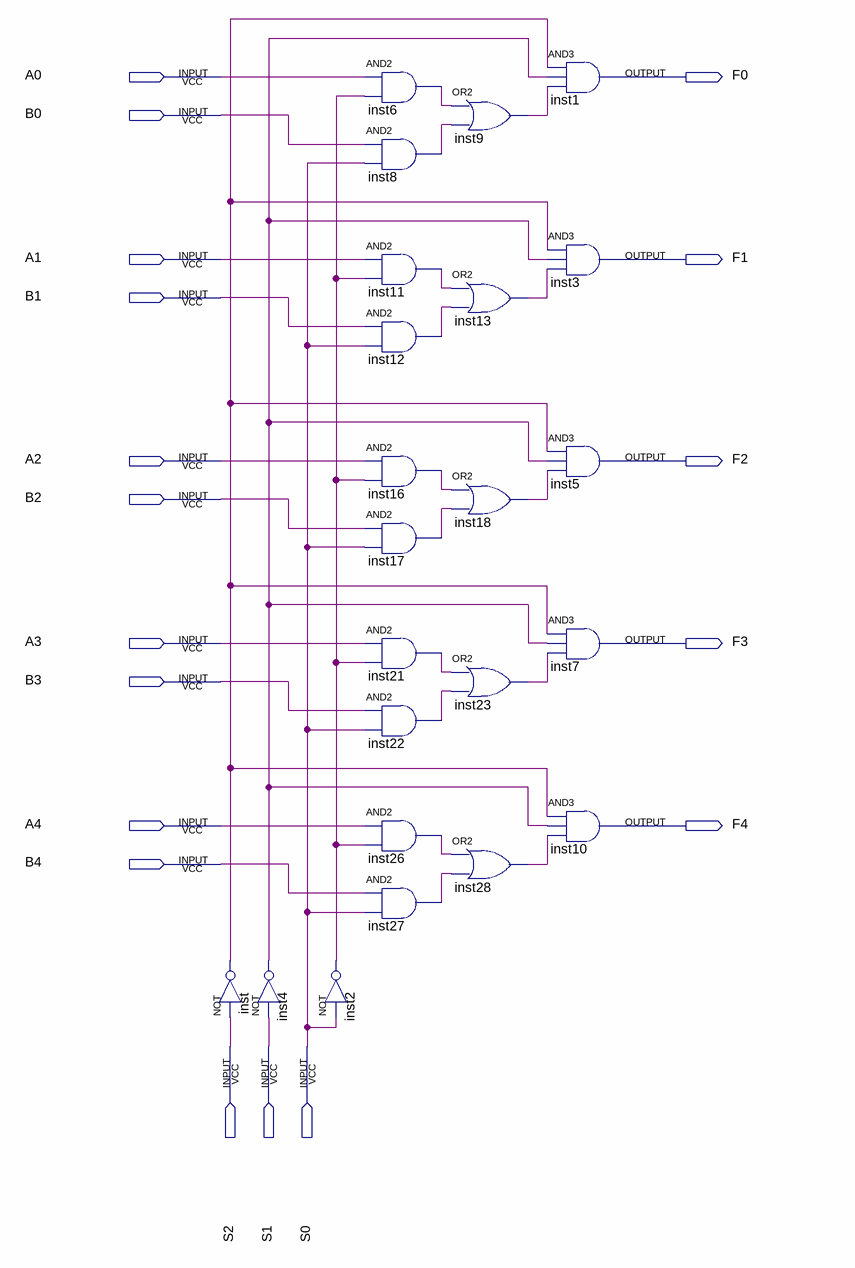
[diagram p0: schematic sheet]
// Quartus schematic DEC_S1.bdf as structural Verilog: 23 symbols, 18 pins
module DEC_S1 (
  input  A0,
  input  B0,
  input  A1,
  input  B1,
  input  A2,
  input  B2,
  input  A3,
  input  B3,
  input  A4,
  input  B4,
  input  S2,
  input  S1,
  input  S0,
  output F0,
  output F1,
  output F2,
  output F3,
  output F4
);

  wire inst2_out, inst4_out, inst6_out, inst8_out, inst9_out, inst11_out, inst12_out, inst13_out, inst16_out,
       inst17_out, inst18_out, inst21_out, inst22_out, inst23_out, inst26_out, inst27_out, inst28_out,
       inst_out;

  not inst (inst_out, S2);
  not inst4 (inst4_out, S1);
  and inst6 (inst6_out, A0, inst2_out);
  and inst8 (inst8_out, B0, S0);
  and inst11 (inst11_out, A1, inst2_out);
  and inst12 (inst12_out, B1, S0);
  and inst16 (inst16_out, A2, inst2_out);
  and inst17 (inst17_out, B2, S0);
  and inst21 (inst21_out, A3, inst2_out);
  and inst22 (inst22_out, B3, S0);
  and inst26 (inst26_out, A4, inst2_out);
  and inst27 (inst27_out, B4, S0);
  not inst2 (inst2_out, S0);
  or inst9 (inst9_out, inst6_out, inst8_out);
  or inst13 (inst13_out, inst11_out, inst12_out);
  or inst18 (inst18_out, inst16_out, inst17_out);
  or inst23 (inst23_out, inst21_out, inst22_out);
  or inst28 (inst28_out, inst26_out, inst27_out);
  and inst1 (F0, inst_out, inst4_out, inst9_out);
  and inst3 (F1, inst_out, inst4_out, inst13_out);
  and inst5 (F2, inst_out, inst4_out, inst18_out);
  and inst7 (F3, inst_out, inst4_out, inst23_out);
  and inst10 (F4, inst_out, inst4_out, inst28_out);
endmodule
